# Altium schematic sheet SuperFin Baseboard pg4.SchDoc
size A
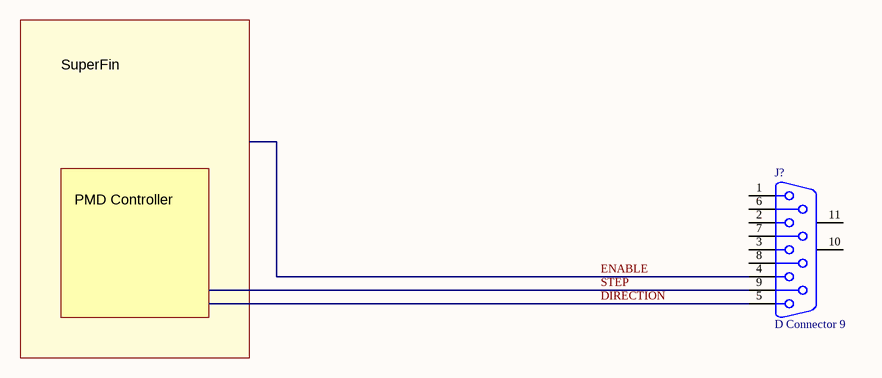
[diagram p0: SuperFin Baseboard pg4.SchDoc]

## Parts
J?  D Connector 9  [DSUB1.385-2H9]

## Nets
DIRECTION: J?.5
ENABLE: J?.4
STEP: J?.9

Not connected (* = marked no-connect by the designer): J? 1 2 3 6 7 8 10(MH1) 11(MH2)

## Notes on the sheet
- SuperFin
- PMD Controller

## Library data of the parts
J? = D Connector 9: Receptacle Assembly, 9 Position, Right Angle; PackageDocument: O; Positions: 9; Published: 15-Jun-2001; LatestRevisionDate: 17-Jul-2002; LatestRevisionNote: Re-released for DXP Platform.; DatasheetDocument: 1-Sep-1999; PackageReference: 788750; Publisher: Altium Limited; Orientation: Right Angle; Gender: Receptacle